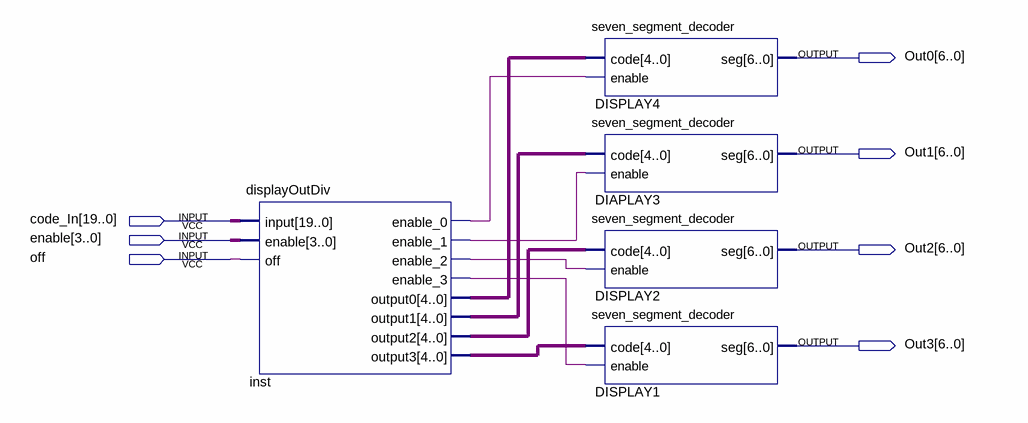
[diagram p0: schematic sheet]
// Quartus schematic Display7seg.bdf as structural Verilog: 5 symbols, 7 pins
module Display7seg (
  input  [19:0] code_In,
  input  [3:0] enable,
  input  off,
  output [6:0] Out0,
  output [6:0] Out1,
  output [6:0] Out2,
  output [6:0] Out3
);

  wire inst_enable_0, inst_enable_1, inst_enable_2, inst_enable_3;
  wire [4:0] inst_output0, inst_output1, inst_output2, inst_output3;

  displayOutDiv inst (
    .\input (code_In), .enable(enable), .off(off), .enable_0(inst_enable_0), .enable_1(inst_enable_1),
    .enable_2(inst_enable_2), .enable_3(inst_enable_3), .output0(inst_output0), .output1(inst_output1),
    .output2(inst_output2), .output3(inst_output3));
  seven_segment_decoder DISPLAY4 (.code(inst_output0), .enable(inst_enable_0), .seg(Out0));
  seven_segment_decoder DIAPLAY3 (.code(inst_output1), .enable(inst_enable_1), .seg(Out1));
  seven_segment_decoder DISPLAY2 (.code(inst_output2), .enable(inst_enable_2), .seg(Out2));
  seven_segment_decoder DISPLAY1 (.code(inst_output3), .enable(inst_enable_3), .seg(Out3));
endmodule
